# Altium schematic sheet IR_recieverUC3M.SchDoc: Adaptador Nutaq
size A4; Author: RCP; DrawnBy: RCP; Engineer: RCP
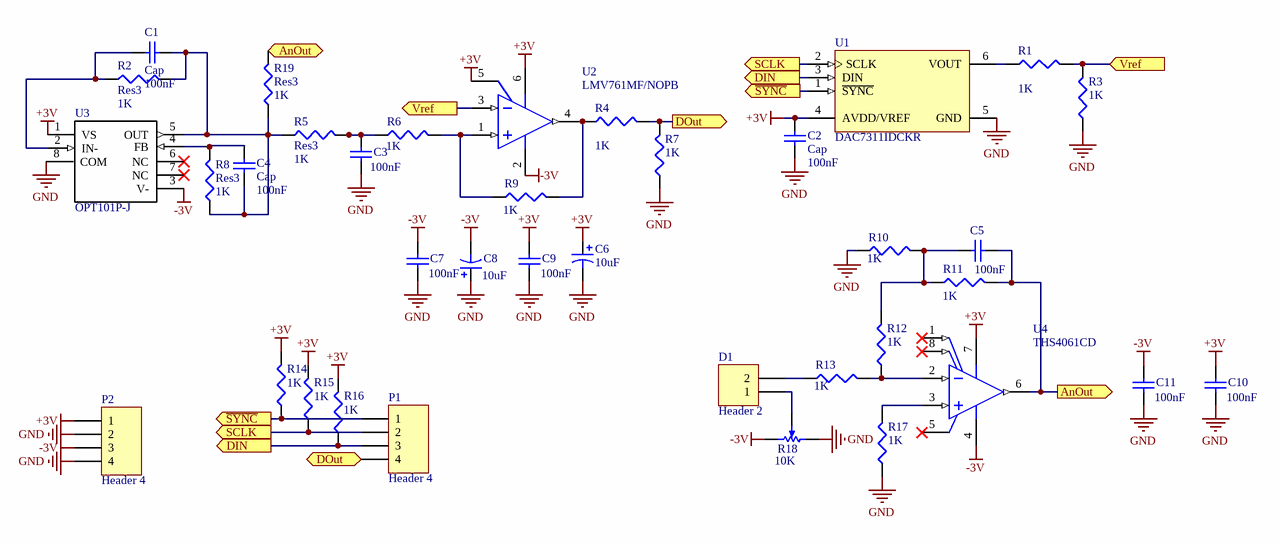
[diagram p0: IR_recieverUC3M.SchDoc]

## Parts
C1  Cap  value 100nF  [1608[0603]]
C2  Cap  value 100nF  [1608[0603]]
C3  value 100nF  [1608[0603]]  (hidden comment: Cap)
C4  Cap  value 100nF  [1608[0603]]
C5  value 100nF  [1608[0603]]  (hidden comment: Cap)
C6  value 10uF  [1608[0603]]  (hidden comment: Cap Pol)
C7  value 100nF  [1608[0603]]  (hidden comment: Cap)
C8  value 10uF  [1608[0603]]  (hidden comment: Cap Pol)
C9  value 100nF  [1608[0603]]  (hidden comment: Cap)
C10  value 100nF  [1608[0603]]  (hidden comment: Cap)
C11  value 100nF  [1608[0603]]  (hidden comment: Cap)
D1  Header 2  [HDR1X2]
P1  Header 4  [HDR1X4]
P2  Header 4  [HDR1X4]
R1  value 1K  [J1-0603]  (hidden comment: Res3)
R2  Res3  value 1K  [J1-0603]
R3  value 1K  [J1-0603]  (hidden comment: Res3)
R4  value 1K  [J1-0603]  (hidden comment: Res3)
R5  Res3  value 1K  [J1-0603]
R6  value 1K  [J1-0603]  (hidden comment: Res3)
R7  value 1K  [J1-0603]  (hidden comment: Res3)
R8  Res3  value 1K  [J1-0603]
R9  value 1K  [J1-0603]  (hidden comment: Res3)
R10  value 1K  [J1-0603]  (hidden comment: Res3)
R11  value 1K  [J1-0603]  (hidden comment: Res3)
R12  value 1K  [J1-0603]  (hidden comment: Res3)
R13  value 1K  [J1-0603]  (hidden comment: Res3)
R14  value 1K  [1608[0603]]  (hidden comment: Res3)
R15  value 1K  [1608[0603]]  (hidden comment: Res3)
R16  value 1K  [1608[0603]]  (hidden comment: Res3)
R17  value 1K  [J1-0603]  (hidden comment: Res3)
R18  value 10K  [POT-3MM-SMD]  (hidden comment: RPot SM)
R19  Res3  value 1K  [J1-0603]
U1  DAC7311IDCKR  [TI-DCK6_V]
U2  LMV761MF/NOPB  [MF06A_N]
U3  OPT101P-J  [DTL0008A_M]
U4  THS4061CD  [TI-D8_M]

## Ports
AnOut (out), DIN (out), DOut (out), SCLK (out), Vref (in), Vref (out), ~{SYNC} (out)

## Nets
+3V: C2.2 C6.1 C9.2 C10.2 P2.1 R14.2 R15.2 R16.2 U1.4(AVDD/VREF) U2.5(~{SD}) U2.6(V+) U3.1(VS) U4.7(VCC+)
-3V: C7.2 C8.2 C11.2 P2.3 R18.CW(+) U2.2(V-) U3.3(V-) U4.4(VCC-)
GND: C2.1 C3.1 C6.2 C7.1 C8.1 C9.1 C10.1 C11.1 P2.2 P2.4 R3.1 R7.1 R10.1 R17.1 R18.CCW(-) U1.5(GND) U3.8(COM)
AnOut: C5.2 R11.2 R19.2 U4.6(OUT) ; port AnOut
DIN: P1.3 R16.1 U1.3(DIN) ; port DIN
DOut: P1.4 R4.2 R7.2 ; port DOut
~{SYNC}: P1.1 R14.1 U1.1(~{SYNC}) ; port ~{SYNC}
SCLK: P1.2 R15.1 U1.2(SCLK) ; port SCLK
Vref: R1.2 R3.2 U2.3(IN-) ; port Vref
NetC1_1: C1.1 R2.1 U3.2(IN-)
NetC1_2: C1.2 C4.1 R2.2 R5.1 R8.1 R19.1 U3.5(OUT)
NetC3_2: C3.2 R5.2 R6.1
NetC4_2: C4.2 R8.2 U3.4(FB)
NetC5_1: C5.1 R10.2 R11.1 R12.2
NetD1_1: D1.1 R18.W
NetD1_2: D1.2 R13.1
NetR1_1: R1.1 U1.6(VOUT)
NetR4_1: R4.1 R9.2 U2.4(OUT)
NetR6_2: R6.2 R9.1 U2.1(IN+)
NetR12_1: R12.1 R13.2 U4.2(IN-)
NetR17_2: R17.2 U4.3(IN+)

Not connected (* = marked no-connect by the designer): U3 6(NC)* 7(NC)*; U4 1(NULL)* 5(NC)* 8(NULL)*

## Library data of the parts
C1-C5 C7 C9-C11 = Cap Semi: Capacitor (Semiconductor SIM Model); Published: 8-Jun-2000; LatestRevisionDate: 29-May-2009; LatestRevisionNote: IPC-7351 Footprint Added.; PackageReference: C1206; Publisher: Altium Limited; PackageDescription: Chip Capacitor
C6 C8 = Cap Pol3: Polarized Capacitor (Surface Mount); Published: 8-Jun-2000; LatestRevisionDate: 29-May-2009; LatestRevisionNote: IPC-7351 Footprint Added.; PackageReference: C0805; Publisher: Altium Limited; PackageDescription: Chip Capacitor
D1 = Header 2: Header, 2-Pin; LatestRevisionDate: 17-Jul-2002; LatestRevisionNote: Re-released for DXP Platform.; Publisher: Altium Limited
P1 P2 = Header 4: Header, 4-Pin; LatestRevisionDate: 17-Jul-2002; LatestRevisionNote: Re-released for DXP Platform.; Publisher: Altium Limited
R1-R17 R19 = Res3: Resistor; Published: 8-Jun-2000; LatestRevisionDate: 29-May-2009; LatestRevisionNote: IPC-7351 Footprint Added.; PackageReference: J1-0603; Publisher: Altium Limited; PackageDescription: Chip Resistor
R18 = RPot SM: Square Trimming Potentiometer; Published: 17-Dec-2003; DatasheetVersion: Oct-2003; PackageReference: POT4MM-2; Publisher: Altium Limited; PackageDescription: Square Trimming Potentiometer; ComponentLink1Description: Manufacturer Link; ComponentLink1URL: http://bourns.com/2/search.html
U1 = CMP-0004-00359-1: 12-Bit, Single Channel, 80 uA, 1.8 to 5.5 V DAC in SC70 Package, -40 to 125 degC, 6-pin SOT23 (DCK6), Green (RoHS & no Sb/Br); Manufacturer: Texas Instruments; SNR(dB): 81; DNL(Max)(+/-LSB): 1; Resolution(Bits): 12; Settling Time(us): 6; SFDR(dB): 65; Interface: Serial SPI; SubFamily: Precision DAC (=<10MSPS); Power Consumption(Typ)(mW): 0.14; PackageDescription: 6-Pin Plastic Small Outline, Body 2 x 1.25 mm, Pitch 0.65 mm; Mounting Technology: Surface Mount; Eco-Plan: Green (RoHS & no Sb/Br); PackageReference: DCK6; PackageVersion: 4093553-4/G, 01/2007; ComponentLink1URL: http://www.ti.com/; ComponentLink2Description: Datasheet; INL(Max)(+/-LSB): 1; ComponentLink2URL: http://www.ti.com/general/docs/lit/getliterature.tsp?genericPartNumber=DAC7311&fileType=pdf; ComponentLink3URL: http://www.ti.com/litv/pdf/mpds114c; PartNumber: DAC7311IDCKR; DAC Channels: 1; ComponentLink3Description: Package Specification; ComponentLink1Description: Manufacturer URL; DatasheetVersion: SBAS442B; Code_JEDEC: MO-203
U2 = CMP-0055-01152-2: Low Voltage, Precision Comparator with Push-Pull Output, 6-pin SOT-23, Pb-Free; Manufacturer: National Semiconductor; PowerWise: N; CompType: Amplifiers; PackageTopMarking: C22A*XTT; Code_JEDEC: MO-178-AB; RoHS: Y; ComponentLink1Description: LMV761 Datasheet; PackageReference: MF06A; ComponentLink2URL: http://www.national.com/pf/LM/LMV761.html; ComponentLink3URL: http://www.national.com/packaging/folders/mf06a.html; Code_IPC: SOT26A-6; RevisionNote: Component URLs added; ComponentLink1URL: http://www.national.com/ds/LM/LMV761.pdf; DatasheetVersion: Jul-2002; PackageDescription: Molded SOT-23, .115 x .063 x .040in Body, 6 Lead, .0375in in Pitch; PackageVersion: revC, Sep-2005; PinCount: 6; ComponentLink3Description: MF06A Package Page; ComponentLink2Description: LMV761 Web Page
U3 = OPT101P-J: Imported; Manufacturer: Texas Instruments; CompType: IC; PIN_COUNT: 8; Application_BuildNumber: *; PartNumber: OPT101P-J; PackageReference: DTL0008A; MountType: SMT; RoHS: Y; RefDes: RefDes; Type: DEV; Value: Value
U4 = THS4061CD: 180 MHz High Output Drive Voltage-Feedback Amplifier, 9 to 32 V, 0 to 70 degC, 8-pin SOIC (D8), Green (RoHS & no Sb/Br); Manufacturer: Texas Instruments; 2nd Harmonic(dBc): 73; 3rd Harmonic(dBc): 88; @ MHz: 1; BW @ Acl(MHz): 180; Diff Gain(%): 0.02; Iib(Max)(nA): 6000; Io(Typ)(mA): 115; Iq per channel(Max)(mA): 11; Settling Time (0.1%)(Typ)(ns): 40; Slew Rate(Typ)(V/us): 400; Sub Family: High Output Current Amplifier (>=50mA), High Speed Amplifier (>=50MHz), High Supply Voltage Amplifier (>=30V); THD (Fc is 1 MHz)(Typ)(dB): -72; Vio(Max)(mV): 8; Vn at Flatband(Typ)(nV/rtHz): 14.5; Vs(Max)(V): 30; Vs(Min)(V): 10; DatasheetVersion: SLOS234E; PackageVersion: 4040047-3/M, 06/2011; PackageReference: D8; PackageDescription: 8-Pin Plastic Small Outline, Body 4.9 x 3.9 mm, Pitch 1.27 mm; Supplier 1: Digi-Key; Supplier Part Number 1: 296-2409-5-ND; Supplier 2: Newark; Supplier Part Number 2: 19C8976; Supplier 3: Mouser; Supplier Part Number 3: 595-THS4061CD; Acl, min stable gain(V/V): 1; Diff Phase(deg): 0.02; Eco-Plan: Green (RoHS & no Sb/Br); Number of Channels: 1; Mounting Technology: Surface Mount; Code_JEDEC: MS-012; PartNumber: THS4061CD; ComponentLink1Description: Manufacturer URL; ComponentLink1URL: http://www.ti.com/; ComponentLink2Description: Datasheet; ComponentLink2URL: http://www.ti.com/general/docs/lit/getliterature.tsp?genericPartNumber=THS4061&fileType=pdf; ComponentLink3Description: Package Specification; ComponentLink3URL: http://www.ti.com/litv/pdf/msoi002j